# EAGLE schematic ControlSystem - v.1.0 (EAGLE 9.5.2)

## Sheet 1 of 2
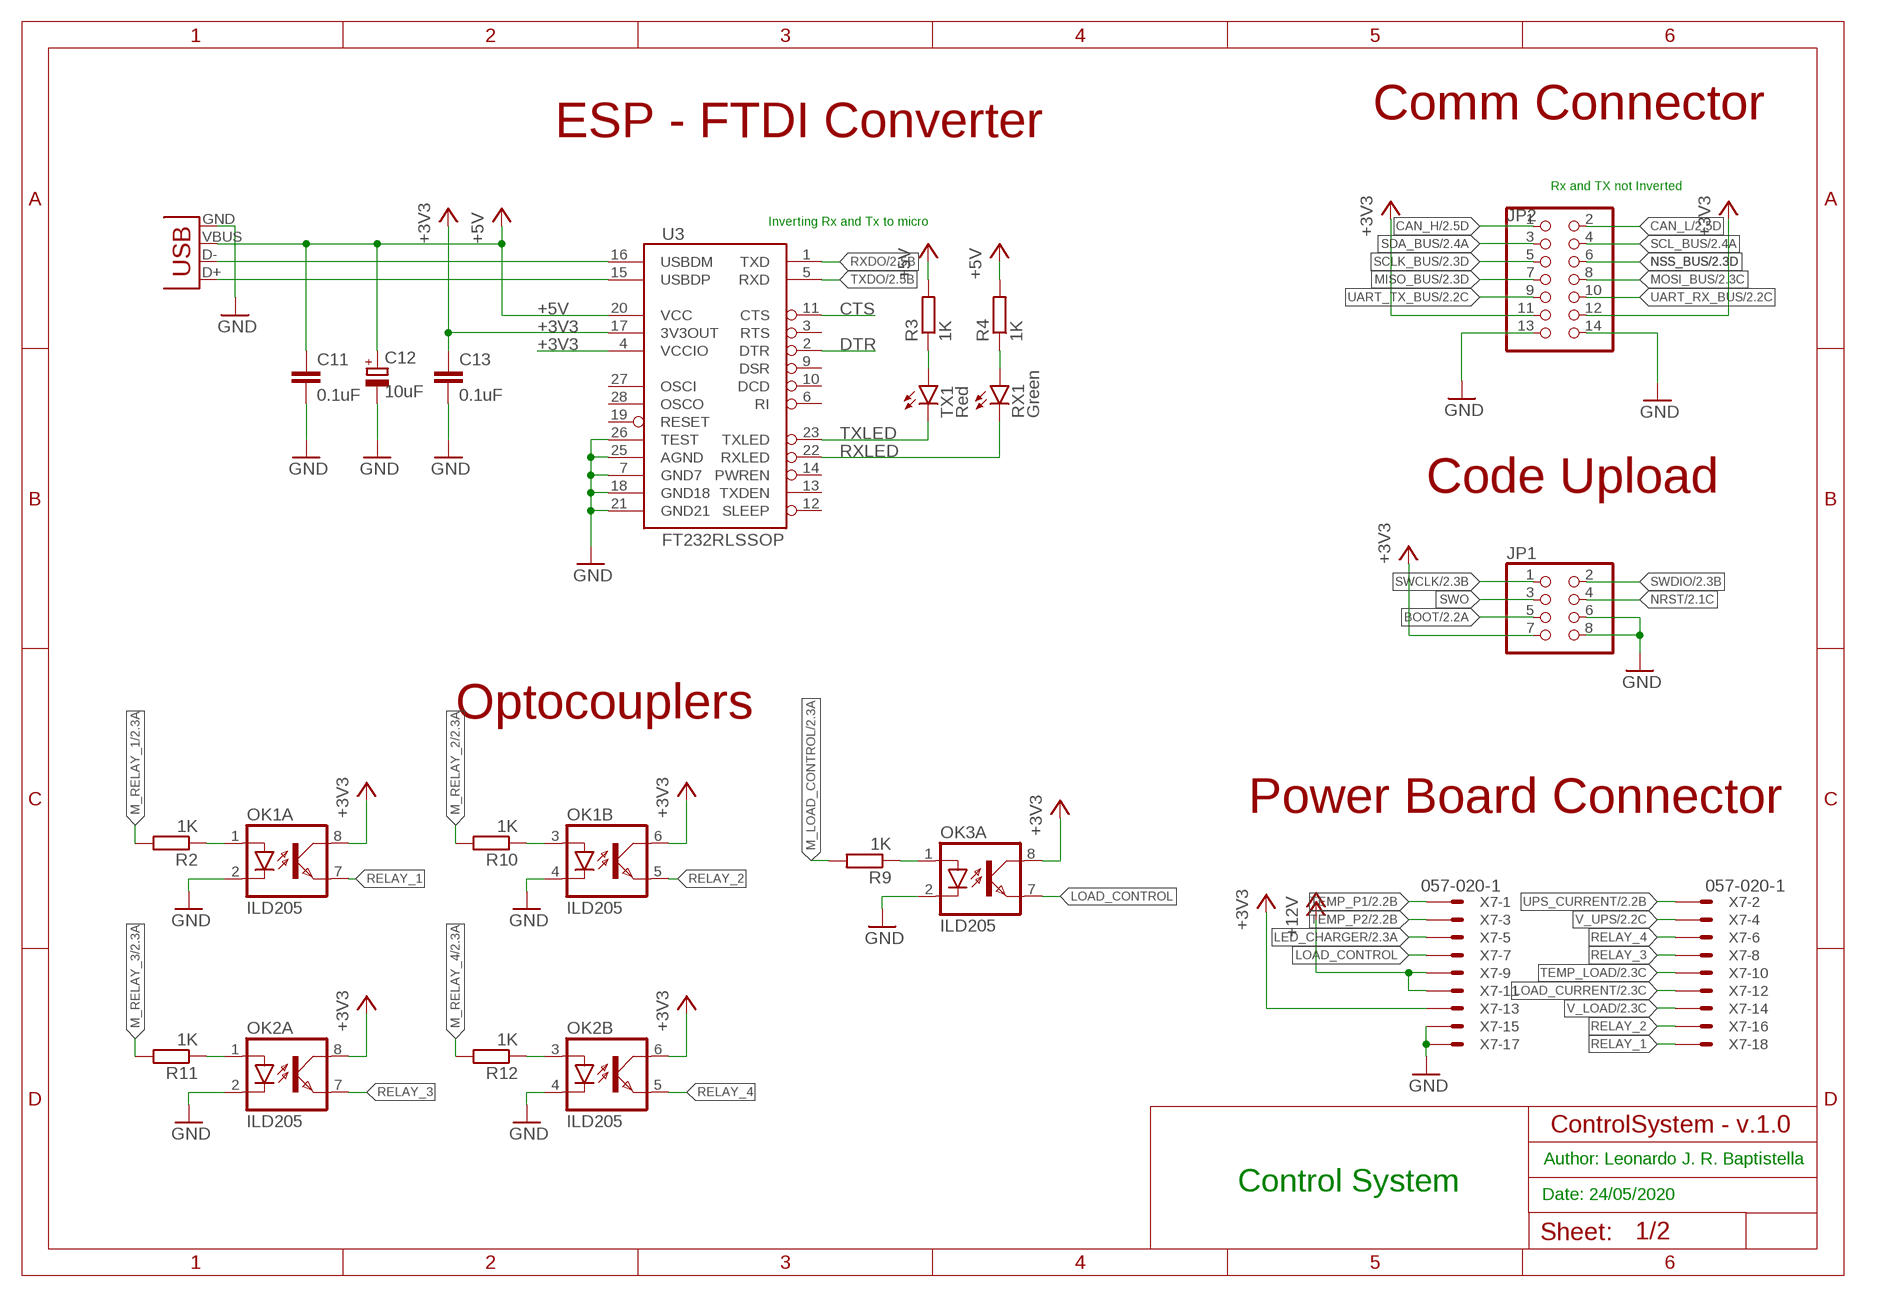
[diagram p0: schematic, sheet 1, part 1 of 2]
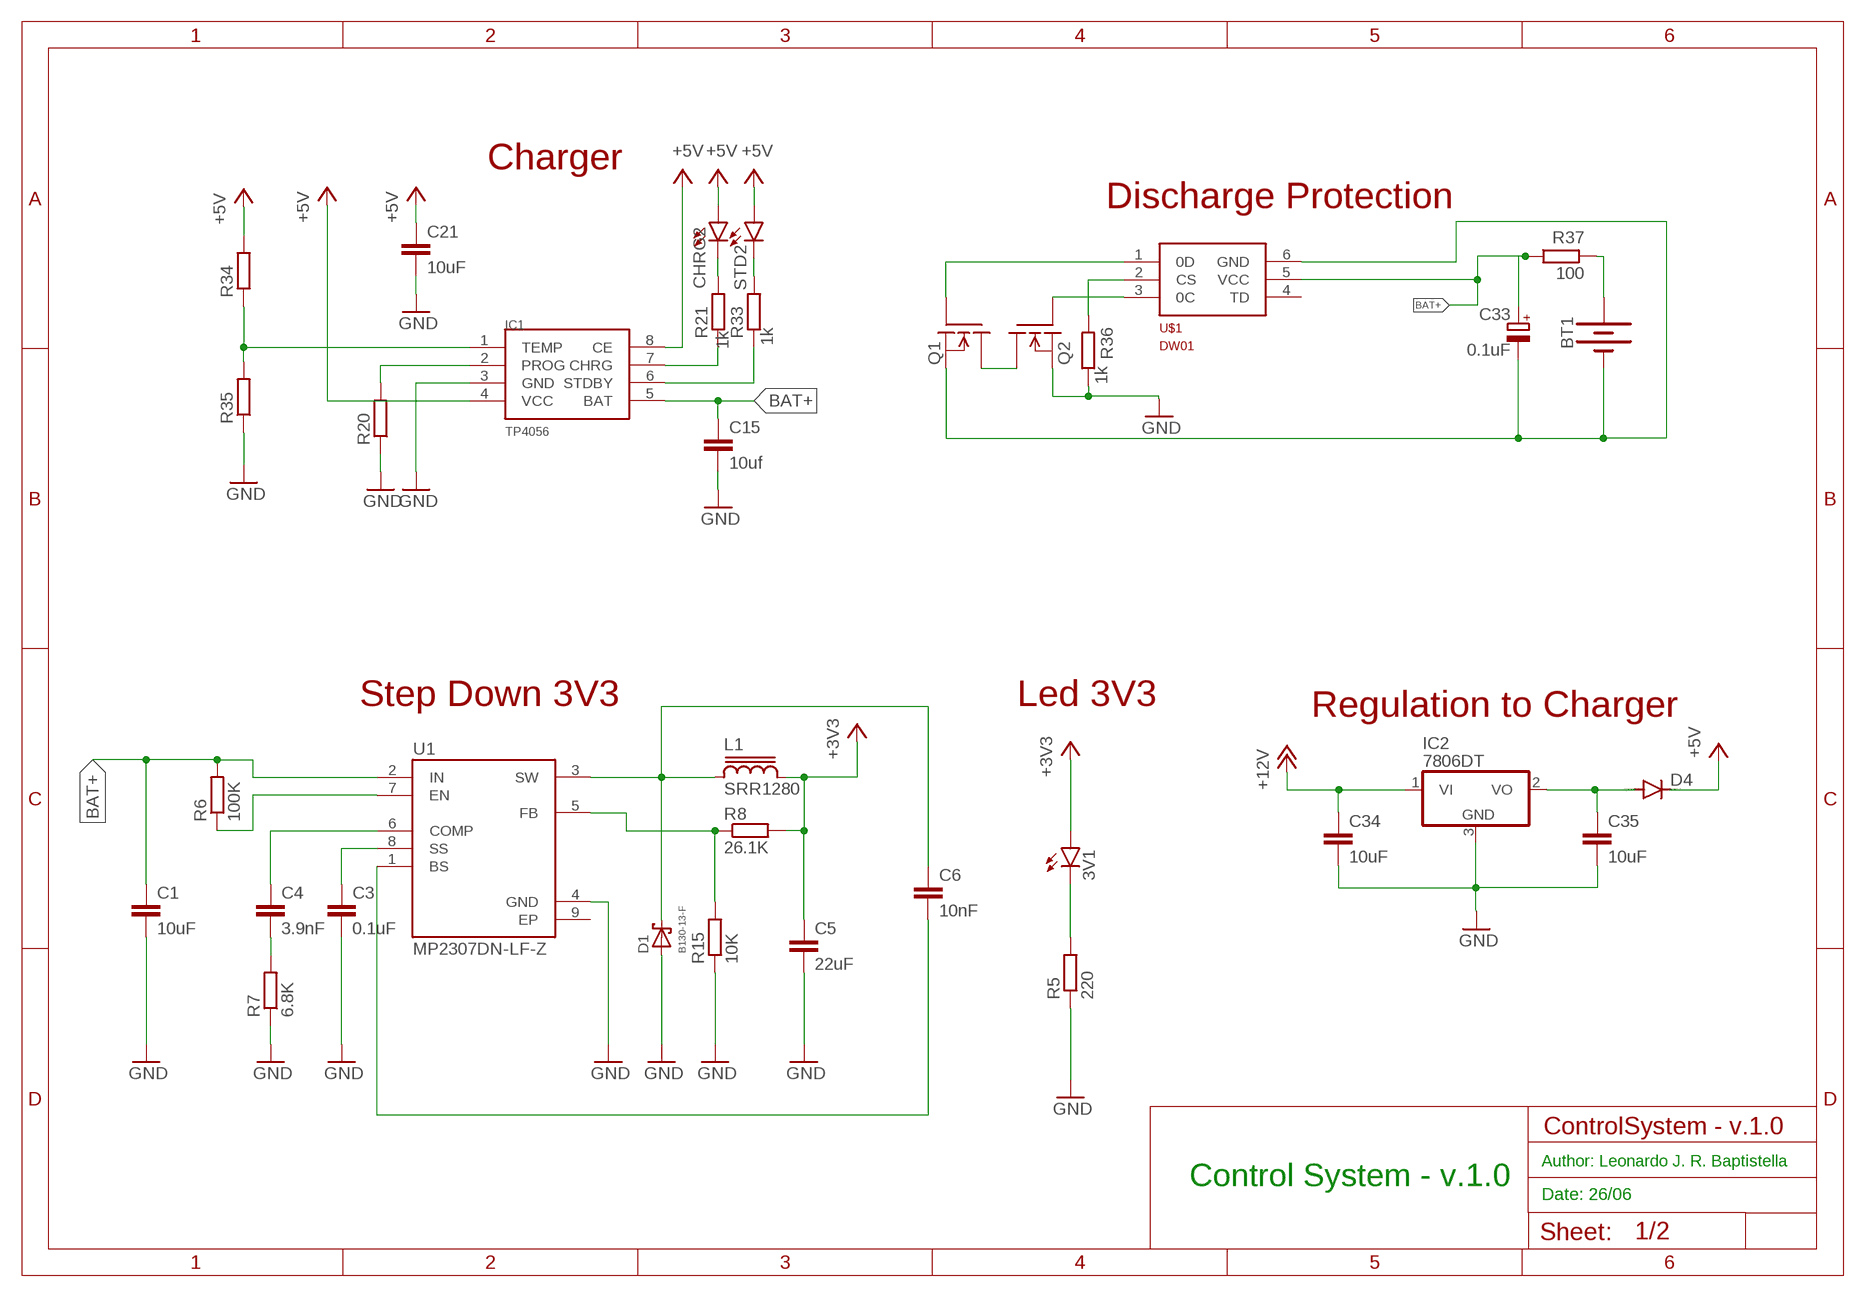
[diagram p1: schematic, sheet 1, part 2 of 2]

### Parts
3V1  LEDCHIPLED_0805  [CHIPLED_0805]
BT1  BATTERY-18650  [BATTERY_18650-HOLDER]
C1  10uF  C-EUC0805  [C0805]
C3  0.1uF  C-EUC0805  [C0805]
C4  3.9nF  C-EUC0805  [C0805]
C5  22uF  C-EUC0805  [C0805]
C6  10nF  C-EUC0805  [C0805]
C11  0.1uF  C-EUC0805  [C0805]
C12  10uF  CPOL-EUB  [PANASONIC_B]
C13  0.1uF  C-EUC0805  [C0805]
C15  10uf  C-EUC0805  [C0805]
C21  10uF  C-EUC0805  [C0805]
C33  0.1uF  CPOL-EUC  [PANASONIC_C]
C34  10uF  C-EUC0805  [C0805]
C35  10uF  C-EUC0805  [C0805]
CHRG2  LEDCHIP-LED0805  [CHIP-LED0805]
D1  B130-13-F  [SMA]
D4  DIODE-DO214BA  [DO214BA]
IC1  TP4056  [SOP-8]
IC2  7806DT  [TO252]
JP1  PINHD-2X4  [2X04]
JP2  PINHD-2X7  [2X07]
L1  SRR1280  [SRR1280]
OK1  ILD205  [SOIC08]
OK2  ILD205  [SOIC08]
OK3  ILD205  [SOIC08]
Q1  SSM3K329R  [SOT23]
Q2  SSM3K329R  [SOT23]
R2  1K  R-EU_R0805  [R0805]
R3  1K  R-EU_R0805  [R0805]
R4  1K  R-EU_R0805  [R0805]
R5  220  R-EU_R0805  [R0805]
R6  100K  R-EU_R0805  [R0805]
R7  6.8K  R-EU_R0805  [R0805]
R8  26.1K  R-EU_R0805  [R0805]
R9  1K  R-EU_R0805  [R0805]
R10  1K  R-EU_R0805  [R0805]
R11  1K  R-EU_R0805  [R0805]
R12  1K  R-EU_R0805  [R0805]
R15  10K  R-EU_R0805  [R0805]
R20  R-EU_R0805  [R0805]
R21  1k  R-EU_R0805  [R0805]
R33  1k  R-EU_R0805  [R0805]
R34  R-EU_R0805  [R0805]
R35  R-EU_R0805  [R0805]
R36  1k  R-EU_R0805  [R0805]
R37  100  R-EU_R0805  [R0805]
RX1  Green  LEDCHIPLED_0805  [CHIPLED_0805]
STD2  LEDCHIP-LED0805  [CHIP-LED0805]
TX1  Red  LEDCHIPLED_0805  [CHIPLED_0805]
U1  MP2307DN-LF-Z  [SOIC127P600X170-9N]
U3  FT232RLSSOP  [SSOP28DB]
U$1  DW01  [SOT23-6]
X1  USB-SMD-NS  [USB-MINIB-NOSTOP]
X7  057-020-1  [057-020-1]

### Nets
+3V3: 3V1.A C5.1 C13.1 JP1.7 JP2.11 L1.2 OK1.6(B:COL) OK1.8(A:COL) OK2.6(B:COL) OK2.8(A:COL) OK3.8(A:COL) R8.2 U3.4(VCCIO) U3.17(3V3OUT) X7.13 ; also sheet 2
+5V: C11.1 C12.+ C21.1 CHRG2.A D4.C IC1.4(VCC) IC1.8(CE) R3.2 R4.2 R34.2 STD2.A U3.20(VCC) X1.VBUS
+12V: C34.1 IC2.1(VI) X7.9 X7.11
BAT+: C1.1 C15.1 C33.+ IC1.5(BAT) R6.2 R37.1 U1.2(IN) U$1.5(VCC)
BOOT: JP1.5 ; also sheet 2
CAN_H: JP2.1 ; also sheet 2
CAN_L: JP2.2 ; also sheet 2
CTS: U3.11(CTS)
DTR: U3.2(DTR)
GND: C1.2 C3.2 C5.2 C11.2 C12.- C13.2 C15.2 C21.2 C34.2 C35.2 D1.A IC1.3(GND) IC2.3(GND) JP1.6 JP1.8 JP2.13 OK1.2(A:C) OK1.4(B:C) OK2.2(A:C) OK2.4(B:C) OK3.2(A:C) Q2.2(S) R5.1 R7.1 R15.1 R20.1 R35.1 R36.1 U1.4(GND) U3.7(GND7) U3.18(GND18) U3.21(GND21) U3.25(AGND) U3.26(TEST) X1.GND X7.15 X7.17 ; also sheet 2
LED_CHARGER: X7.5 ; also sheet 2
LOAD_CONTROL: OK3.7(A:EMIT) X7.7
LOAD_CURRENT: X7.12 ; also sheet 2
M_LOAD_CONTROL: R9.2 ; also sheet 2
M_RELAY_1: R2.2 ; also sheet 2
M_RELAY_2: R10.2 ; also sheet 2
M_RELAY_3: R11.2 ; also sheet 2
M_RELAY_4: R12.2 ; also sheet 2
MISO_BUS: JP2.7 ; also sheet 2
MOSI_BUS: JP2.8 ; also sheet 2
N$2: JP2.14 ; supply symbol labelled GND
N$3: R3.1 TX1.A
N$4: R4.1 RX1.A
N$5: JP2.12 ; supply symbol labelled +3V3
N$6: OK1.1(A:A) R2.1
N$7: OK3.1(A:A) R9.1
N$8: 3V1.C R5.2
N$9: R6.1 U1.7(EN)
N$10: C4.2 R7.2
N$11: C3.1 U1.8(SS)
N$12: C4.1 U1.6(COMP)
N$13: C6.1 D1.C L1.1 U1.3(SW)
N$14: R8.1 R15.2 U1.5(FB)
N$15: OK1.3(B:A) R10.1
N$16: OK2.1(A:A) R11.1
N$17: OK2.3(B:A) R12.1
N$18: C6.2 U1.1(BS)
N$19: IC1.2(PROG) R20.2
N$27: IC1.7(CHRG) R21.1
N$28: IC1.6(STDBY) R33.1
N$29: CHRG2.C R21.2
N$30: R33.2 STD2.C
N$51: IC1.1(TEMP) R34.1 R35.2
N$52: R36.2 U$1.2(CS)
N$53: Q1.1(G) U$1.1(0D)
N$54: Q1.3(D) Q2.3(D)
N$55: Q2.1(G) U$1.3(0C)
N$56: BT1.PWR@1(+) R37.2
N$57: BT1.GND@1(-) C33.- Q1.2(S) U$1.6(GND)
N$58: C35.1 D4.A IC2.2(VO)
NRST: JP1.4 ; also sheet 2
NSS_BUS: JP2.6 ; also sheet 2
RELAY_1: OK1.7(A:EMIT) X7.18
RELAY_2: OK1.5(B:EMIT) X7.16
RELAY_3: OK2.7(A:EMIT) X7.8
RELAY_4: OK2.5(B:EMIT) X7.6
RXDO: U3.1(TXD) ; also sheet 2
RXLED: RX1.C U3.22(RXLED)
SCL_BUS: JP2.4 ; also sheet 2
SCLK_BUS: JP2.5 ; also sheet 2
SDA_BUS: JP2.3 ; also sheet 2
SWCLK: JP1.1 ; also sheet 2
SWDIO: JP1.2 ; also sheet 2
SWO: JP1.3
TEMP_LOAD: X7.10 ; also sheet 2
TEMP_P1: X7.1 ; also sheet 2
TEMP_P2: X7.3 ; also sheet 2
TXDO: U3.5(RXD) ; also sheet 2
TXLED: TX1.C U3.23(TXLED)
UART_RX_BUS: JP2.10 ; also sheet 2
UART_TX_BUS: JP2.9 ; also sheet 2
UPS_CURRENT: X7.2 ; also sheet 2
USB_D+1: U3.15(USBDP) X1.D+
USB_D-1: U3.16(USBDM) X1.D-
V_LOAD: X7.14 ; also sheet 2
V_UPS: X7.4 ; also sheet 2
Unconnected: OK3.3(B:A) OK3.4(B:C) OK3.5(B:EMIT) OK3.6(B:COL) U3.3(RTS) U3.6(RI) U3.9(DSR) U3.10(DCD) U3.12(SLEEP) U3.13(TXDEN) U3.14(PWREN) U3.19(RESET) U3.27(OSCI) U3.28(OSCO) U$1.4(TD) X7.19 X7.20

### Notes on the sheet
- Comm Connector
- ESP - FTDI Converter
- Charger
- Rx and TX not Inverted
- Discharge Protection
- Inverting Rx and Tx to micro
- Code Upload
- Step Down 3V3 | Led 3V3
- Optocouplers | Regulation to Charger
- Power Board Connector
- Author: Leonardo J. R. Baptistella | Author: Leonardo J. R. Baptistella
- Control System | Control System - v.1.0
- Date: 24/05/2020 | Date: 26/06

## Sheet 2 of 2
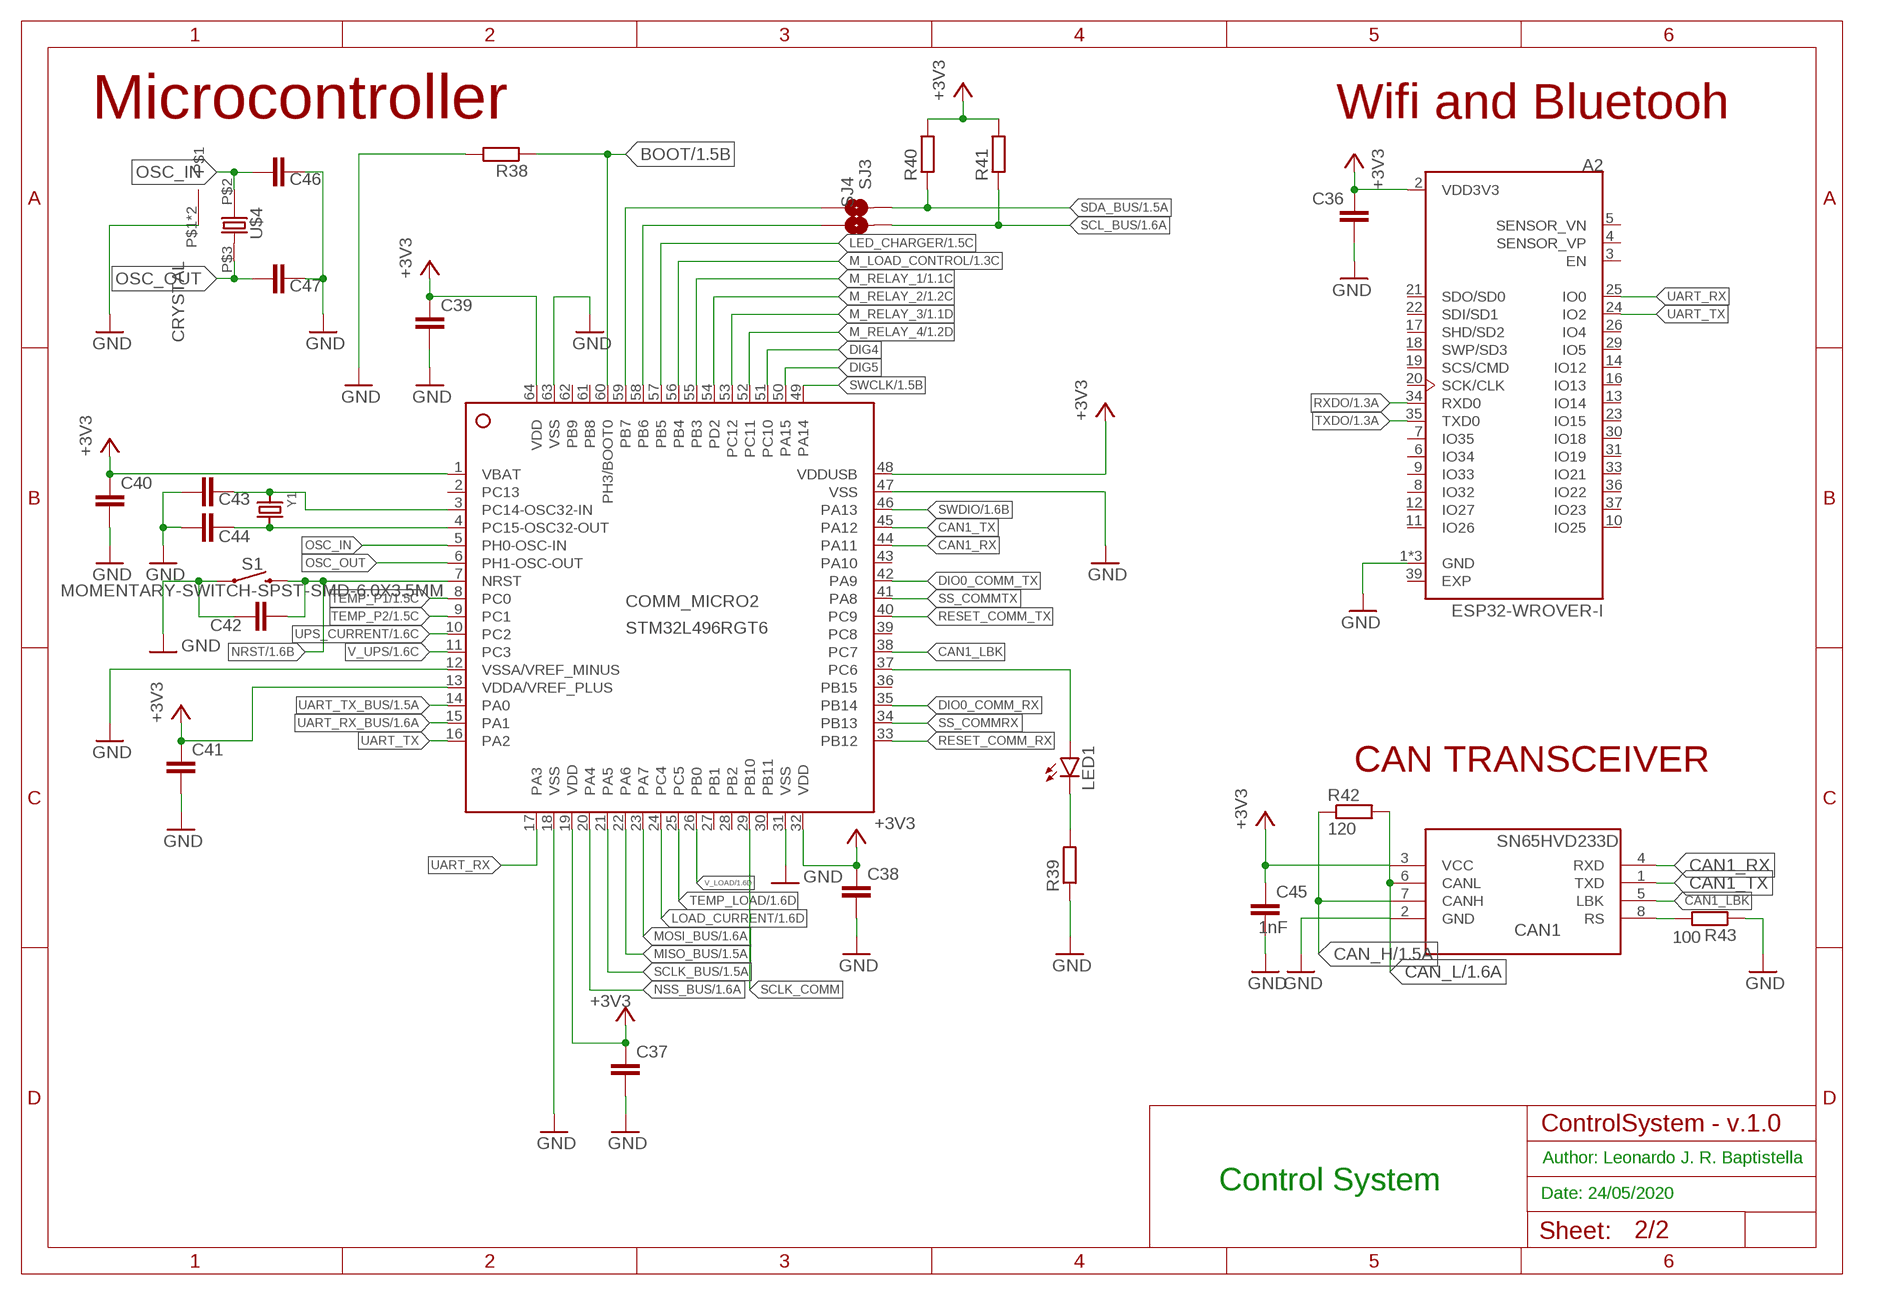
[diagram p2: schematic, sheet 2]

### Parts
A2  ESP32-WROVER-I  [XCVR_ESP32-WROVER-I]
C36  C-EUC0805  [C0805]
C37  C-EUC0805  [C0805]
C38  C-EUC0805  [C0805]
C39  C-EUC0805  [C0805]
C40  C-EUC0805  [C0805]
C41  C-EUC0805  [C0805]
C42  C-EUC0805  [C0805]
C43  C-EUC0805  [C0805]
C44  C-EUC0805  [C0805]
C45  1nF  C-EUC1206  [C1206]
C46  C-EUC0805  [C0805]
C47  C-EUC0805  [C0805]
CAN1  SN65HVD233D  [SOIC8]
COMM_MICRO2  STM32L496RGT6  [LQFP64_10X10]
LED1  LEDCHIP-LED0805  [CHIP-LED0805]
R38  R-EU_R0805  [R0805]
R39  R-EU_R0805  [R0805]
R40  R-EU_R0805  [R0805]
R41  R-EU_R0805  [R0805]
R42  120  R-EU_R1206  [R1206]
R43  100  R-EU_R0805  [R0805]
S1  MOMENTARY-SWITCH-SPST-SMD-6.0X3.5MM  [TACTILE_SWITCH_SMD_6.0X3.5MM]
SJ3  SMD-JUMPER-2  [SMD-JUMPER-2]
SJ4  SMD-JUMPER-2  [SMD-JUMPER-2]
U$4  CRYSTAL  [CRYSTAL_SMD]
Y1  CRYSTAL8X3.8SMT  [CRYSTAL_8X3.8]

### Nets
+3V3: A2.2(VDD3V3) C36.1 C37.1 C38.1 C39.1 C40.1 C41.1 C45.1 CAN1.3(VCC) COMM_MICRO2.1(VBAT) COMM_MICRO2.13(VDDA/VREF_PLUS) COMM_MICRO2.19(VDD) COMM_MICRO2.32(VDD) COMM_MICRO2.48(VDDUSB) COMM_MICRO2.64(VDD) R40.2 R41.2 ; also sheet 1
BOOT: COMM_MICRO2.60(PH3/BOOT0) R38.1 ; also sheet 1
CAN1_LBK: CAN1.5(LBK) COMM_MICRO2.38(PC7)
CAN1_RX: CAN1.4(RXD) COMM_MICRO2.44(PA11)
CAN1_TX: CAN1.1(TXD) COMM_MICRO2.45(PA12)
CAN_H: CAN1.7(CANH) R42.1 ; also sheet 1
CAN_L: CAN1.6(CANL) R42.2 ; also sheet 1
DIG4: COMM_MICRO2.51(PC10)
DIG5: COMM_MICRO2.50(PA15)
DIO0_COMM_RX: COMM_MICRO2.35(PB14)
DIO0_COMM_TX: COMM_MICRO2.42(PA9)
GND: A2.1(GND) A2.15(GND) A2.38(GND) C36.2 C37.2 C38.2 C39.2 C40.2 C41.2 C42.1 C43.1 C44.1 C45.2 C46.2 C47.2 CAN1.2(GND) COMM_MICRO2.12(VSSA/VREF_MINUS) COMM_MICRO2.18(VSS) COMM_MICRO2.31(VSS) COMM_MICRO2.47(VSS) COMM_MICRO2.63(VSS) R38.2 R39.1 R43.1 S1.1 U$4.P$1 U$4.P$4 ; also sheet 1
LED_CHARGER: COMM_MICRO2.57(PB5) ; also sheet 1
LOAD_CURRENT: COMM_MICRO2.24(PC4) ; also sheet 1
M_LOAD_CONTROL: COMM_MICRO2.56(PB4) ; also sheet 1
M_RELAY_1: COMM_MICRO2.55(PB3) ; also sheet 1
M_RELAY_2: COMM_MICRO2.54(PD2) ; also sheet 1
M_RELAY_3: COMM_MICRO2.53(PC12) ; also sheet 1
M_RELAY_4: COMM_MICRO2.52(PC11) ; also sheet 1
MISO_BUS: COMM_MICRO2.22(PA6) ; also sheet 1
MOSI_BUS: COMM_MICRO2.23(PA7) ; also sheet 1
N$84: COMM_MICRO2.37(PC6) LED1.A
N$85: LED1.C R39.2
N$86: C43.2 COMM_MICRO2.3(PC14-OSC32-IN) Y1.P$1
N$87: C44.2 COMM_MICRO2.4(PC15-OSC32-OUT) Y1.P$4
N$88: COMM_MICRO2.59(PB7) SJ3.1
N$89: COMM_MICRO2.58(PB6) SJ4.1
N$90: CAN1.8(RS) R43.2
NRST: C42.2 COMM_MICRO2.7(NRST) S1.2 ; also sheet 1
NSS_BUS: COMM_MICRO2.20(PA4) ; also sheet 1
OSC_IN: C46.1 COMM_MICRO2.5(PH0-OSC-IN) U$4.P$2
OSC_OUT: C47.1 COMM_MICRO2.6(PH1-OSC-OUT) U$4.P$3
RESET_COMM_RX: COMM_MICRO2.33(PB12)
RESET_COMM_TX: COMM_MICRO2.40(PC9)
RXDO: A2.34(RXD0) ; also sheet 1
SCL_BUS: R41.1 SJ4.2 ; also sheet 1
SCLK_BUS: COMM_MICRO2.21(PA5) ; also sheet 1
SCLK_COMM: COMM_MICRO2.29(PB10)
SDA_BUS: R40.1 SJ3.2 ; also sheet 1
SS_COMMRX: COMM_MICRO2.34(PB13)
SS_COMMTX: COMM_MICRO2.41(PA8)
SWCLK: COMM_MICRO2.49(PA14) ; also sheet 1
SWDIO: COMM_MICRO2.46(PA13) ; also sheet 1
TEMP_LOAD: COMM_MICRO2.25(PC5) ; also sheet 1
TEMP_P1: COMM_MICRO2.8(PC0) ; also sheet 1
TEMP_P2: COMM_MICRO2.9(PC1) ; also sheet 1
TXDO: A2.35(TXD0) ; also sheet 1
UART_RX: A2.25(IO0) COMM_MICRO2.17(PA3)
UART_RX_BUS: COMM_MICRO2.15(PA1) ; also sheet 1
UART_TX: A2.24(IO2) COMM_MICRO2.16(PA2)
UART_TX_BUS: COMM_MICRO2.14(PA0) ; also sheet 1
UPS_CURRENT: COMM_MICRO2.10(PC2) ; also sheet 1
V_LOAD: COMM_MICRO2.26(PB0) ; also sheet 1
V_UPS: COMM_MICRO2.11(PC3) ; also sheet 1
Unconnected: A2.3(EN) A2.4(SENSOR_VP) A2.5(SENSOR_VN) A2.6(IO34) A2.7(IO35) A2.8(IO32) A2.9(IO33) A2.10(IO25) A2.11(IO26) A2.12(IO27) A2.13(IO14) A2.14(IO12) A2.16(IO13) A2.17(SHD/SD2) A2.18(SWP/SD3) A2.19(SCS/CMD) A2.20(SCK/CLK) A2.21(SDO/SD0) A2.22(SDI/SD1) A2.23(IO15) A2.26(IO4) A2.29(IO5) A2.30(IO18) A2.31(IO19) A2.33(IO21) A2.36(IO22) A2.37(IO23) COMM_MICRO2.2(PC13) COMM_MICRO2.27(PB1) COMM_MICRO2.28(PB2) COMM_MICRO2.30(PB11) COMM_MICRO2.36(PB15) COMM_MICRO2.39(PC8) COMM_MICRO2.43(PA10) COMM_MICRO2.61(PB8) COMM_MICRO2.62(PB9)

### Notes on the sheet
- Microcontroller | Wifi and Bluetooh
- CAN TRANSCEIVER
- Author: Leonardo J. R. Baptistella
- Control System
- Date: 24/05/2020

## Power pins joined to a net without a drawn wire
EP: U1.9(EP)
EXP: A2.39(EXP)

## Library data of the parts
3V1 CHRG2 LED1 RX1 STD2 TX1 = led:LED: LED OSRAM: - CHIPLED LG R971, LG N971, LY N971, LG Q971, LY Q971, LO R971, LY R971 LH N974, LH R974 LS Q976, LO Q976, LY Q976 LO Q996 - Hyper CHIPLED LW Q18S LB Q993, LB Q99A, LB R99A - SideLED LS A670, LO A670, LY A670, LG A670, LP A670 LB A673, LV A673, LT A673, LW A673 LH A674 LY A675 LS A676, LA A676, LO A676, LY A676, LW A676 LS A679, LY A679, LG A679 - Hyper Micro SIDELED® LS Y876, LA Y876, LO Y876, LY Y876 LT Y87S - SmartLED LW L88C, LW L88S LB L89C, LB L89S, LG L890 LS L89K, LO L89K, LY L89K LS L896, LA L896, LO L896, LY L896 - TOPLED LS T670, LO T670, LY T670, LG T670, LP T670 LSG T670, LSP T670, LSY T670, LOP T670, LYG T670 LG T671, LOG T671, LSG T671 LB T673, LV T673, LT T673, LW T673 LH T674 LS T676, LA T676, LO T676, LY T676, LB T676, LH T676, LSB T676, LW T676 LB T67C, LV T67C, LT T67C, LS T67K, LO T67K, LY T67K, LW E67C LS E67B, LA E67B, LO E67B, LY E67B, LB E67C, LV E67C, LT E67C LW T67C LS T679, LY T679, LG T679 LS T770, LO T770, LY T770, LG T770, LP T770 LB T773, LV T773, LT T773, LW T773 LH T774 LS E675, LA E675, LY E675, LS T675 LS T776, LA T776, LO T776, LY T776, LB T776 LHGB T686 LT T68C, LB T68C - Hyper Mini TOPLED® LB M676 - Mini TOPLED Santana® LG M470 LS M47K, LO M47K, LY M47K Source: http://www.osram.convergy.de LUXEON: - LUMILED® LXK2-PW12-R00, LXK2-PW12-S00, LXK2-PW14-U00, LXK2-PW14-V00 LXK2-PM12-R00, LXK2-PM12-S00, LXK2-PM14-U00 LXK2-PE12-Q00, LXK2-PE12-R00, LXK2-PE12-S00, LXK2-PE14-T00, LXK2-PE14-U00 LXK2-PB12-K00, LXK2-PB12-L00, LXK2-PB12-M00, LXK2-PB14-N00, LXK2-PB14-P00, LXK2-PB14-Q00 LXK2-PR12-L00, LXK2-PR12-M00, LXK2-PR14-Q00, LXK2-PR14-R00 LXK2-PD12-Q00, LXK2-PD12-R00, LXK2-PD12-S00 LXK2-PH12-R00, LXK2-PH12-S00 LXK2-PL12-P00, LXK2-PL12-Q00, LXK2-PL12-R00 Source: www.luxeon.com KINGBRIGHT: KA-3528ASYC Source: www.kingbright.com
A2 = ESP32-WROVER-I:ESP32-WROVER-I: Module: combo; GPIO, I2C x2, I2S x2, SDIO, SPI x3, UART x3; U.FL; AVAILABILITY: Unavailable; DESCRIPTION: Bluetooth, WiFi 802.11b/g/n, Bluetooth v4.2 +EDR, Class 1, 2 and 3 Transceiver Module 2.4GHz ~ 2.5GHz Antenna Not Included, I-PEX Surface Mount; MF: Espressif Systems; MP: ESP32-WROVER-I; PACKAGE: Module Espressif Systems; PRICE: None
BT1 = SparkFun-Batteries:BATTERY: Battery - Single Cell A variety of battery chemistries, sizes, and footprints. Device List: 20MM_PTH - Coin Cell Battery Holder - 20mm (PTH) <https://www.sparkfun.com/products/783> 6.8MM_PTH - Coin Cell Battery Holder - 6.8MM(SMD) <https://www.digikey.com/product-detail/en/seiko-instruments/MS621FE-FL11E/728-1057-ND/1889208?WT.srch=1&gclid=CNOQ5a6LzdQCFZS2wAodXCkE0g> 12MM_SMD - Coin Cell Battery Holder - 12mm (SMD) <https://www.sparkfun.com/products/10592> 12MM_PTH - Coin Cell Battery Holder - 12mm (PTH) <https://www.sparkfun.com/products/7948> 20MM_SMD - 20mm Coin Cell Battery Holder (SMD) (2 legs) Used on the Big Time Watch Kit <https://www.sparkfun.com/products/11734> 20MM_SMD_4LEGS - Coin Cell Battery Holder - 20mm (SMD) <https://www.sparkfun.com/products/11892> 20MM_SMD_4LEGS_OVERPASTE - Coin Cell Battery Holder - 20mm (SMD) <https://www.sparkfun.com/products/11892> (Over-paste on the legs) 24.5MM_PTH - Coin Cell Battery Holder - 24.5mm (PTH) <https://www.sparkfun.com/products/8863> 9V - 9V Battery Holder - PC Mount Used on the SparkFun SparkPunk Sound Kit <https://www.sparkfun.com/products/11177> and SparkFun SparkPunk Sequencer Kit <https://www.sparkfun.com/products/12707> 18650 - Battery Holder - 18650 (PTH) <https://www.sparkfun.com/products/13113> AA - Battery Holder - 1xAA (PTH) <https://www.sparkfun.com/products/7949> AAA - Battery Holder - 1xAAA (PTH) <https://www.sparkfun.com/products/12718> AA_KIT - Battery Holder - 1xAA (PTH) <https://www.sparkfun.com/products/7949> Special kit package - pads only have exposed copper on one side of the board. AAA_KIT - Battery Holder - 1xAAA (PTH) <https://www.sparkfun.com/products/12718> Special kit package - pads only have exposed copper on one side of the board.; PROD_ID: BATT-12327; SF_SKU: PRT-13113
C1 C3-C6 C11 C13 C15 C21 C34-C47 = rcl:C-EU: CAPACITOR, European symbol; SPICEPREFIX: C
C12 C33 = rcl:CPOL-EU: POLARIZED CAPACITOR, European symbol; SPICEPREFIX: C
CAN1 = SN65HVD233D:SN65HVD233D; AVAILABILITY: Unavailable; DESCRIPTION: 3.3V CAN Transceiver with Standby Mode, Loop-back 8-SOIC -40 to 125; MF: Texas Instruments; MP: SN65HVD233D; PACKAGE: SOIC-8 Texas Instruments; PRICE: None
COMM_MICRO2 = STM32L4xxx:STM32L496R*: STM32L496RX LQFP64 Cortex M4, 80MHz, 512kB-1024kB Flash, 320kB SRAM Datasheet STM32L496XX <http://www.st.com/content/ccc/resource/technical/document/datasheet/group3/3f/73/19/d1/d4/9e/48/34/DM00284211/files/DM00284211.pdf/jcr:content/translations/en.DM00284211.pdf>; FARNELL: 2725138; FLASH: 1024kB; SRAM: 320kB
D1 = B130-13-F:B130-13-F; AVAILABILITY: Unavailable; DESCRIPTION: Diode Schottky 30V 1A Surface Mount SMA; MF: Multicomp; MP: B130-13-F; PACKAGE: DO-214 Multicomp; PRICE: None
D4 = diode:DIODE-: DIODE
IC1 = TP4056:TP4056
IC2 = linear:78*: Positive VOLTAGE REGULATOR Source: http://cache.national.com/ds/LM/LM78L05.pdf http://www.fairchildsemi.com/ds/LM/LM7805.pdf
JP1 = pinhead:PINHD-2X4: PIN HEADER
JP2 = pinhead:PINHD-2X7: PIN HEADER
L1 = inductor-bourns:SRR1280: POWER INDUCTOR
OK1-OK3 = optocoupler:ILD2*: Siemens ILD205/206/207/211/213/217 DUAL PHOTOTRANSISTOR SMALL OUTLINE SURFACE MOUNT OPTOCOUPLER Source: 153385-da-01-en-Optocoupler_ILD205-T.pdf; MF: VISHAY/TELEFUNKEN; MPN: ILD205T; OC_FARNELL: 1469512; OC_NEWARK: 20H8678
Q1 Q2 = SSM3K329R:SSM3K329R; AVAILABILITY: Unavailable; DESCRIPTION: N-Channel 60V 115mA (Tc) 225mW (Ta) Surface Mount SOT-23-3 (TO-236); MF: STMicroelectronics; MP: 2N7002; PACKAGE: SOT-23-3 Vishay; PRICE: None
R2-R12 R15 R20 R21 R33-R43 = rcl:R-EU_: RESISTOR, European symbol; SPICEPREFIX: R
S1 = SparkFun-Switches:MOMENTARY-SWITCH-SPST: Momentary Switch (Pushbutton) - SPST Normally-open (NO) SPST momentary switches (buttons, pushbuttons). Variants PTH-12MM - 12mm square, through-hole Momentary Pushbutton Switch - 12mm Square <https://www.sparkfun.com/products/9190> (COM-09190) PTH-6.0MM, PTH-6.0MM-KIT - 6.0mm square, through-hole Mini Pushbutton Switch <https://www.sparkfun.com/products/97> (COM-00097) KIT package intended for soldering kit's - only one side of pads' copper is exposed. PTH-RIGHT-ANGLE-KIT - Right-angle, through-hole Right Angle Tactile Button <https://www.sparkfun.com/products/10791> - Used on SparkFun BigTime Watch Kit <https://www.sparkfun.com/products/11734> SMD-12MM - 12mm square, surface-mount Tactile Button - SMD (12mm) <https://www.sparkfun.com/products/12993> (COM-12993) Used on SparkFun PicoBoard <https://www.sparkfun.com/products/11888> SMD-4.5MM - 4.5mm Square Trackball Switch Used on SparkFun Blackberry Trackballer Breakout <https://www.sparkfun.com/products/13169> SMD-4.6MMX2.8MM - 4.60mm x 2.80mm, surface mount Used on SparkFun SAMD21 Mini Breakout <https://www.sparkfun.com/products/13664> SMD-5.2MM, SMD-5.2-REDUNDANT - 5.2mm square, surface-mount Mini Pushbutton Switch - SMD <https://www.sparkfun.com/products/8720> (COM-08720) Used on Arduino Pro Mini <https://www.sparkfun.com/products/11114> REDUNDANT package connects both switch circuits together SMD-6.0X3.5MM - 6.0 x 3.5mm, surface mount Momentary Reset Switch SMD <https://www.sparkfun.com/products/8229> (COM-08229) SMD-6.2MM-TALL - 6.2mm square, surface mount Tactile Button - SMD (6mm) <https://www.sparkfun.com/products/12992> Used on SparkFun Digital Sandbox <https://www.sparkfun.com/products/12651> SMD-RIGHT-ANGLE - Right-angle, surface mount Used on SparkFun Block for Intel® Edison - Arduino <https://www.sparkfun.com/products/13036>; PROD_ID: SWCH-00815; SF_SKU: COM-08229
SJ3 SJ4 = FaBo-PIN:SMD-JUMPER-2
U1 = MP2307DN-LF-Z:MP2307DN-LF-Z: MP2307 Series 23 V 3 A 380 KHz Synchronous Rectified Step-Down Converter-SOIC-8; AVAILABILITY: Unavailable; DESCRIPTION: Buck Switching Regulator IC Positive Adjustable 0.925V 1 Output 3A 8-SOIC _0.154, 3.90mm Width_ Exposed Pad; MF: Monolithic Power; MP: MP2307DN-LF-Z; PACKAGE: SOIC-8 Monolithic Power; PRICE: None
U3 = SparkFun:FT232RL: USB UART FT232RL 4th Generation USB UART (USB <-> Serial) Controller. Spark Fun Electronics SKU : COM-00650
U$1 = DW01:DW01: The DW01-P battery protection IC is designed to protect lithium-ion/polymer battery from damage or degrading the lifetime due to overcharge, overdischarge, and/or overcurrent for one-cell lithium-ion/polymer battery powered systems, such as cellular phones. Data sheet <http://goo.gl/4y108d> Dave.Calaway Eagle Library <https://goo.gl/Muy1Tr>
U$4 = cristal:CRYSTAL
X1 = SparkFun:USB: USB Connectors USB-B-PTH is fully proven SKU : PRT-00139 USB-miniB is fully proven SKU : PRT-00587 USB-A-PCB is untested. USB-A-H is throughly reviewed, but untested. Spark Fun Electronics SKU : PRT-00437 USB-B-SMT is throughly reviewed, but untested. Needs silkscreen touching up. USB-A-S has not been used/tested USB-MB-H has not been used/tested
X7 = con-panduit:057-020-: CONNECTOR 20-pin series 057 contact pc board low profile headers; OC_FARNELL: unknown; OC_NEWARK: unknown
Y1 = microbuilder:CRYSTAL: Crystals HC49UP - Surface Mount Crystal 4.0MHz 18pF +/-30ppm Surface Mount Crystal [Digikey: 535-9857-1-ND] 12.0 MHz Surface Mount Crystal [Digikey: 535-9869-6-ND] 25.0 MHz Surface Mount Crystal [Digikey: 535-9078-1-ND] 2.5 x 2.0mm - MEMs SMT Crystal 16.0 MHz 10pF 20ppm 2.5 x 2.0mm Crystal [Digikey -40-85°C: 535-10923-1-ND] 3.2 x 2.5mm - MEMs SMT Crystal 12.0 MHz 8pF 15ppm 3.2 x 2.5mm Crystal [Digikey: -10-70°C: 644-1047-1-ND -40-125°C: 644-1128-1-ND] 16.0 MHz 8pF 15ppm 3.2 x 2.5mm Crystal [Digikey: -10-70°C: 644-1049-1-ND -40-125°C: 644-1129-2-ND] 16.0 MHz 10pF 10ppm 3.2 x 2.5mm Crystal [Digikey: 644-1100-1-ND] 27.12 MHz 18pF 30ppm 3.2 x 2.5mm Crystal [Digikey: 887-1424-1-ND] 27.12MHz 10pF 10ppm 3.2 x 2.5mm Crystal [Digikey: 887-1329-1-ND] 4.9 x 1.8mm - MEMs SMT Crystal 32.768 KHz 12.5pF 20ppm 4.9 x 1.8mm Crystal [Digikey: SE2415CT-ND] 8.0 x 3.8mm - Surface Mount Crystal 32.768kHz 12.5pF 20ppm -40°C-85°C [Digikey: 535-9166-2-ND] Cylinder 32.768KHz Cylinder Crystal (2x6mm body) [Ex. Digikey: 300-8341-2-ND]

## Net classes
1 power: width 0.254 mm